# Altium project HV Interface.PrjPcb (part 2 of 2)

## Sheet MCU.SchDoc
size Letter; DocumentNumber: 5; SheetNumber: 5; SheetTotal: 7
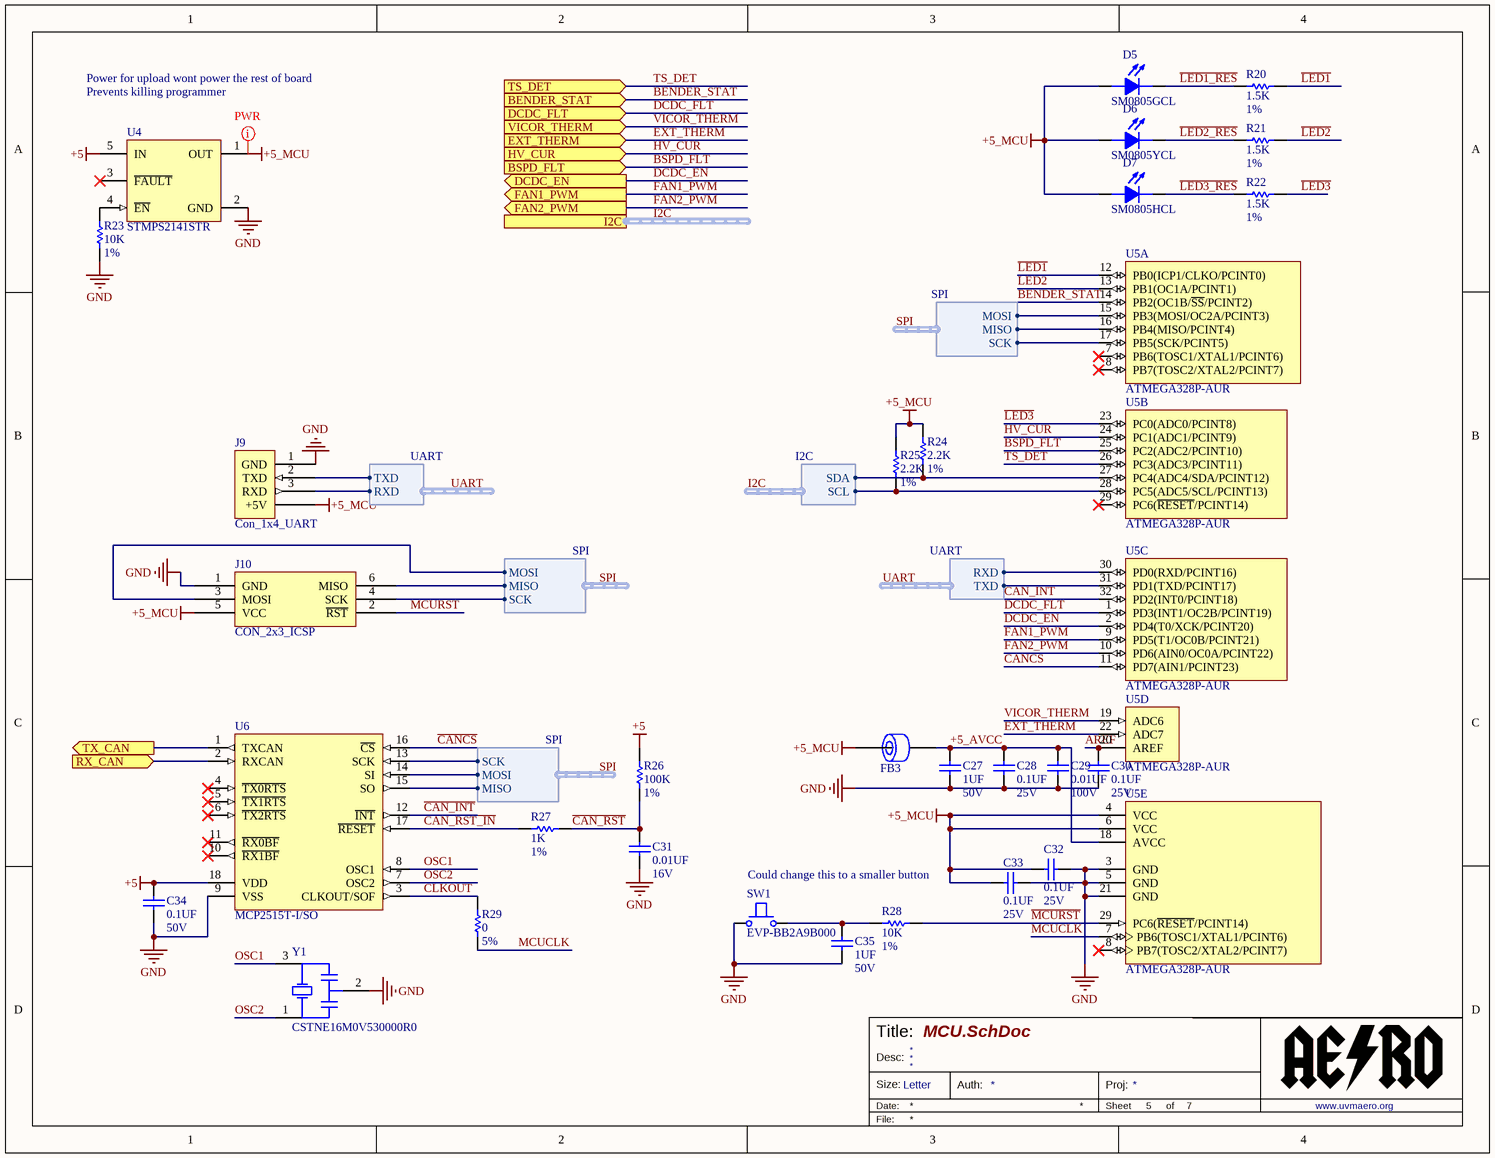
[diagram p3: MCU.SchDoc]

### Parts
C27  Val: 1UF  Vol: 50V  [0603_CAP]  (hidden comment: CAP 0603 1UF 50V 10% X7R)
C28  Val: 0.1UF  Vol: 25V  [0603_CAP]  (hidden comment: CAP 0603 0.1UF 25V 10% X7R)
C29  Val: 0.01UF  Vol: 100V  [0603_CAP]  (hidden comment: CAP 0603 0.01UF 100V 10% X7R)
C30  Val: 0.1UF  Vol: 25V  [0603_CAP]  (hidden comment: CAP 0603 0.1UF 25V 10% X7R)
C31  Val: 0.01UF  Vol: 16V  [0603_CAP]  (hidden comment: CAP 0603 0.01UF 16V 10% X7R)
C32  Val: 0.1UF  Vol: 25V  [0603_CAP]  (hidden comment: CAP 0603 0.1UF 25V 10% X7R)
C33  Val: 0.1UF  Vol: 25V  [0603_CAP]  (hidden comment: CAP 0603 0.1UF 25V 10% X7R)
C34  Val: 0.1UF  Vol: 50V  [0603_CAP]  (hidden comment: CAP 0603 0.1UF 50V 10% X7R)
C35  Val: 1UF  Vol: 50V  [0603_CAP]  (hidden comment: CAP 0603 1UF 50V 10% X7R)
D5  SM0805GCL  [LEDC2012X135N_SM0805GCL(Primary)]
D6  SM0805YCL  [LEDC2012X135N_SM0805YCL(Primary)]
D7  SM0805HCL  [LEDC2012X135N_SM0805HCL(Primary)]
FB3  Ferrite Chip 2500 Ohms  [0603]  (value not drawn)
J9  Con_1x4_UART  [Con 1x4 UART]
J10  CON_2x3_ICSP  [CON_2x3_ICSP]
R20  Val: 1.5K  Tol: 1%  [0603_RES]  (hidden comment: RES 0603 1.5K 1%)
R21  Val: 1.5K  Tol: 1%  [0603_RES]  (hidden comment: RES 0603 1.5K 1%)
R22  Val: 1.5K  Tol: 1%  [0603_RES]  (hidden comment: RES 0603 1.5K 1%)
R23  Val: 10K  Tol: 1%  [0603_RES]  (hidden comment: RES 0603 10K 1%)
R24  Val: 2.2K  Tol: 1%  [0603_RES]  (hidden comment: RES 0603 2.2K 1%)
R25  Val: 2.2K  Tol: 1%  [0603_RES]  (hidden comment: RES 0603 2.2K 1%)
R26  Val: 100K  Tol: 1%  [0603_RES]  (hidden comment: RES 0603 100K 1%)
R27  Val: 1K  Tol: 1%  [0603_RES]  (hidden comment: RES 0603 1K 1%)
R28  Val: 10K  Tol: 1%  [0603_RES]  (hidden comment: RES 0603 10K 1%)
R29  Val: 0  Tol: 5%  [0603_RES]  (hidden comment: RES 0603 0 5%)
SW1  EVP-BB2A9B000  [EVP-BB2A9B000]
U4  STMPS2141STR  [SOT95P280X145-5N]
U5  ATMEGA328P-AUR  [TQFP80P900X900X120-32N]  (parts A,B,C,D,E of 5)
U6  MCP2515T-I/SO  [SOIC-18]
Y1  CSTNE16M0V530000R0  [MURA-CSTCE_G_A-3_V]

### Ports
BENDER_STAT (in), BSPD_FLT (in), DCDC_EN (out), DCDC_FLT (in), EXT_THERM (in), FAN1_PWM (out), FAN2_PWM (out), HV_CUR (in), I2C (harness I2C), RX_CAN (in), TS_DET (in), TX_CAN (out), VICOR_THERM (in)

### Harnesses
I2C: SCL, SDA
SPI: MOSI, MISO, SCK
UART: RXD, TXD

### Nets
+5: C34.2 R26.2 U4.5(IN) U6.18(VDD)
+5_MCU: C32.1 C33.1 D5.A D6.A D7.A FB3.1 J9.4(+5V) J10.5(VCC) R24.2 R25.2 U4.1(OUT) U5.4(VCC) U5.6(VCC)
GND: C27.1 C28.1 C29.1 C30.1 C31.1 C32.2 C33.2 C34.1 C35.1 J9.1(GND) J10.1(GND) R23.1 SW1.A U4.2(GND) U5.3(GND) U5.5(GND) U5.21(GND) U6.9(VSS) Y1.2(GND)
+5_AVCC: C27.2 C28.2 C29.2 FB3.2 U5.18(AVCC)
~{CAN_INT}: U5.32(PD2(INT0/PCINT18)) U6.12(~{INT})
~{CAN_RST}: C31.2 R26.1 R27.2
~{CAN_RST_IN}: R27.1 U6.17(~{RESET})
~{CANCS}: U5.11(PD7(AIN1/PCINT23)) U6.16(~{CS})
~{LED1}: R20.2 U5.12(PB0(ICP1/CLKO/PCINT0))
~{LED1_RES}: D5.C R20.1
~{LED2}: R21.2 U5.13(PB1(OC1A/PCINT1))
~{LED2_RES}: D6.C R21.1
~{LED3}: R22.2 U5.23(PC0(ADC0/PCINT8))
~{LED3_RES}: D7.C R22.1
~{MCURST}: J10.2(~{RST}) R28.1 U5.29(PC6(~{RESET}/PCINT14))
AREF: C30.2 U5.20(AREF)
BENDER_STAT: U5.14(PB2(OC1B/~{SS}/PCINT2)) ; port BENDER_STAT
BSPD_FLT: U5.25(PC2(ADC2/PCINT10)) ; port BSPD_FLT  [project net BSPD_FAULT]
CLKOUT: R29.1 U6.3(CLKOUT/SOF)
DCDC_EN: U5.2(PD4(T0/XCK/PCINT20)) ; port DCDC_EN
DCDC_FLT: U5.1(PD3(INT1/OC2B/PCINT19)) ; port DCDC_FLT
EXT_THERM: U5.22(ADC7) ; port EXT_THERM  [project net EXT_NTC_N]
FAN1_PWM: U5.9(PD5(T1/OC0B/PCINT21)) ; port FAN1_PWM
FAN2_PWM: U5.10(PD6(AIN0/OC0A/PCINT22)) ; port FAN2_PWM
HV_CUR: U5.24(PC1(ADC1/PCINT9)) ; port HV_CUR  [project net CUR_OUT]
I2C.SCL: R25.1 U5.28(PC5(ADC5/SCL/PCINT13)) ; port I2C.SCL
I2C.SDA: R24.1 U5.27(PC4(ADC4/SDA/PCINT12)) ; port I2C.SDA
MCUCLK: R29.2 U5.7(PB6(TOSC1/XTAL1/PCINT6))
OSC1: U6.8(OSC1) Y1.3(X2)
OSC2: U6.7(OSC2) Y1.1(X1)
RX: U6.2(RXCAN) ; port RX_CAN
SPI.MISO: J10.6(MISO) U5.16(PB4(MISO/PCINT4)) U6.15(SO) ; harness SPI.MISO
SPI.MOSI: J10.3(MOSI) U5.15(PB3(MOSI/OC2A/PCINT3)) U6.14(SI) ; harness SPI.MOSI
SPI.SCK: J10.4(SCK) U5.17(PB5(SCK/PCINT5)) U6.13(SCK) ; harness SPI.SCK
TS_DET: U5.26(PC3(ADC3/PCINT11)) ; port TS_DET
TX: U6.1(TXCAN) ; port TX_CAN
UART.RXD: J9.3(RXD) U5.30(PD0(RXD/PCINT16)) ; harness UART.RXD
UART.TXD: J9.2(TXD) U5.31(PD1(TXD/PCINT17)) ; harness UART.TXD
VICOR_THERM: U5.19(ADC6) ; port VICOR_THERM  [project net VICOR_NTC]
NetC35_2: C35.2 R28.2 SW1.B
NetR23_2: R23.2 U4.4(~{EN})

Not connected (* = marked no-connect by the designer): U4 3(~{FAULT})*; U5 8(PB7(TOSC2/XTAL2/PCINT7))*; U6 4(~{TX0RTS})* 5(~{TX1RTS})* 6(~{TX2RTS})* 10(~{RX1BF})* 11(~{RX0BF})*

### Buses and harness runs
harness I2C = port I2C

### Layout directives
net class PWR; net class PWR_RAIL: +5_MCU

### Notes on the sheet
- Power for upload wont power the rest of board
- Prevents killing programmer
- Could change this to a smaller button
- Title:
- Size:
- Date:
- Desc:
- Letter
- Auth:
- Sheet
- Proj:
- *
- of
- www.uvmaero.org
- File:

### Library data of the parts
C27 C35 = CAP 0603 1UF 50V 10% X7R: Capacitor Surface Mount 0603 Footprint 1UF 50V 10% Tolerance Ceramic X7R; Manufacturer: Various; PCB Package: 0603; Description in Visual: Cap SMT 0603 1UF 50V 10% Ceramic X7R; P/N: CAP 0603 1UF 50V 10% X7R; Manufacturer P/N: Various; Value: 1UF; Voltage: 50V; Tolerance: 10%; Type: Ceramic X7R; ComponentLink1Description: Manufacturer Website; ComponentLink2Description: Component Datasheet; ComponentLink3Description: Octopart Link
C28 C30 C32 C33 = CAP 0603 0.1UF 25V 10% X7R: Capacitor Surface Mount 0603 Footprint 0.1UF 25V 10% Tolerance Ceramic X7R; Manufacturer: Various; PCB Package: 0603; Description in Visual: Cap SMT 0603 0.1UF 25V 10%  Cer X7R; P/N: CAP 0603 0.1UF 25V 10% X7R; Manufacturer P/N: Various; Value: 0.1UF; Voltage: 25V; Tolerance: 10%; Type: Ceramic X7R; ComponentLink1Description: Manufacturer Website; ComponentLink2Description: Component Datasheet; ComponentLink3Description: Octopart Link
C29 = CAP 0603 0.01UF 100V 10% X7R: Capacitor Surface Mount 0603 Footprint 0.01UF 100V 10% Tolerance Ceramic X7R; Manufacturer: Various; PCB Package: 0603; Description in Visual: Cap SMT 0603 0.01UF 100V 10%  Cer X7R; P/N: CAP 0603 0.01UF 100V 10% X7R; Manufacturer P/N: Various; Value: 0.01UF; Voltage: 100V; Tolerance: 10%; Type: Ceramic X7R; ComponentLink1Description: Manufacturer Website; ComponentLink2Description: Component Datasheet; ComponentLink3Description: Octopart Link
C31 = CAP 0603 0.01UF 16V 10% X7R: Capacitor Surface Mount 0603 Footprint 0.01UF 16V 10% Tolerance Ceramic X7R; Manufacturer: Various; PCB Package: 0603; Description in Visual: Cap SMT 0603 0.01UF 16V 10%  Cer X7R; P/N: CAP 0603 0.01UF 16V 10% X7R; Manufacturer P/N: Various; Value: 0.01UF; Voltage: 16V; Tolerance: 10%; Type: Ceramic X7R; ComponentLink1Description: Manufacturer Website; ComponentLink2Description: Component Datasheet; ComponentLink3Description: Octopart Link
C34 = CAP 0603 0.1UF 50V 10% X7R: Capacitor Surface Mount 0603 Footprint 0.1UF 50V 10% Tolerance Ceramic X7R; Manufacturer: Various; PCB Package: 0603; Description in Visual: Cap SMT 0603 0.1UF 50V 10%  Cer X7R; P/N: CAP 0603 0.1UF 50V 10% X7R; Manufacturer P/N: Various; Value: 0.1UF; Voltage: 50V; Tolerance: 10%; Type: Ceramic X7R; ComponentLink1Description: Manufacturer Website; ComponentLink2Description: Component Datasheet; ComponentLink3Description: Octopart Link
D5 = SM0805GCL: Green 574nm LED Indication - Discrete 1.9V 0805 (2012 Metric); Manufacturer: Bivar; Forward Current: 2mA; Lens Color: Colorless; Lens Transparency: Clear; Luminous Intensity: 3.6mcd; Viewing Angle: 130°; Supplier 1: Digi-Key; Supplier Part Number 1: 492-2525-1-ND; Case Code (Imperial): 0805; Case Code (Metric): 2012; Case/Package: 0805; Category: LEDs; Color: Green; Dominant Wavelength: 574nm; Forward Voltage: 1.9V; Height: 0.8mm; Illumination Color: Green; Lead Free: Lead Free; Length: 2mm; Manufacturer Part Number: SM0805GCL; Max Operating Temperature: 80°C; Min Operating Temperature: -30°C; Mount: Surface Mount; Package Quantity: 4000; Packaging: Tape and Reel; Test Current: 2mA; Width: 1.2mm
D6 = SM0805YCL: Yellow 592nm LED Indication - Discrete 1.9V 0805 (2012 Metric); Manufacturer: Bivar; Forward Current: 2mA; Lens Color: Colorless; Lens Transparency: Clear; Luminous Intensity: 11.5mcd; Viewing Angle: 130°; Case Code (Imperial): 0805; Case Code (Metric): 2012; Case/Package: 0805; Category: LEDs; Color: Yellow; Dominant Wavelength: 592nm; Forward Voltage: 1.9V; Height: 0.8mm; Illumination Color: Yellow; Lead Free: Lead Free; Length: 2mm; Manufacturer Part Number: SM0805YCL; Max Operating Temperature: 80°C; Min Operating Temperature: -30°C; Mount: Surface Mount; Package Quantity: 4000; Packaging: Tape and Reel; Test Current: 2mA; Width: 1.2mm; Supplier 1: Digi-Key; Supplier Part Number 1: 492-2526-1-ND
D7 = SM0805HCL: Red 631nm LED Indication - Discrete 1.9V 0805 (2012 Metric); Manufacturer: Bivar; Forward Current: 2mA; Lens Color: Colorless; Lens Transparency: Clear; Luminous Intensity: 11.5mcd; Power Rating: 78mW; Viewing Angle: 130°; Supplier 1: Digi-Key; Supplier Part Number 1: 492-2281-1-ND; Width: 1.2mm; Case Code (Imperial): 0805; Case Code (Metric): 2012; Case/Package: 0805; Category: LEDs; Color: Red; Dominant Wavelength: 631nm; Forward Voltage: 1.9V; Height: 0.8mm; Illumination Color: Red; Lead Free: Lead Free; Length: 2mm; Manufacturer Part Number: SM0805HCL; Max Operating Temperature: 80°C; Min Operating Temperature: -30°C; Mount: Surface Mount; Package Quantity: 4000; Packaging: Tape and Reel; Test Current: 2mA
FB3 = MMZ1608A252B: Ferrite Chip 200 mA 2500 Ohms Differential Mode - Single 0603 Footprint; Manufacturer: TDK; Description in Visual: Ferrite SMT 200mA 2500Ohm Dif Mode 0603; Usage: Signal Line; Current (mA): 200; Frequency: 100 MHz; Impedance at Freq (ohms): 2500; DC Resistance (ohms): 0.8; P/N: MMZ1608A252B; Manufacturer P/N: MMZ1608A252B; Filter type: Differential Mode - Single; Operating Temperature Range: -55 to +125 °C; PCB Package: 0603; ComponentLink1Description: Manufacturer Website; ComponentLink1URL: http://www.tdk.com/; ComponentLink2Description: Component Datasheet; ComponentLink2URL: http://www.tdk.co.jp/tefe02/e9412_mmz1608.pdf; ComponentLink3Description: Octopart Link; ComponentLink3URL: http://octopart.com/partsearch/#search/requestData&q=MMZ1608A252B
J9 = Con_1x4_UART: Connector Header Through Hole 4 position 0.100" (2.54mm); Manufacturer: Wurth Electronics; Manufacturer Part Number: 61300411121; Connector Type: Male Pin; Gender: Male; Number of Contacts: 4; Pitch: 0.1inch; Supplier Part Number 1: 732-5317-ND; Supplier Part Number 2: H123038-ND; Category: Connectors; Color: Black; Contact Material: Copper; Contact Mating Length: 0.236inch; Contact Plating: Gold; Lead Free: Lead Free; Mount: Through Hole; Number of Positions: 4; Number of Rows: 1; Packaging: Bulk; REACH SVHC: Unknown; Termination: Solder; Supplier 1: Digi-Key; Supplier 2: Digi-Key
J10 = CON_2x3_ICSP: Connector Header Through Hole 6 position 0.100" (2.54mm) for AVR ICSP; Supplier 1: Digi-Key; Supplier 2: Digi-Key; Supplier 3: Allied Electronics; Supplier 4: Digi-Key; Supplier Part Number 1: 732-5295-ND; Supplier Part Number 2: 952-2120-ND; Supplier Part Number 3: 70949531; Supplier Part Number 4: S2011EC-03-ND
R20-R22 = RES 0603 1.5K 1%: Resistor Surface Mount, 1.5K Ohms, 0603 Footprint, 1% Tolerance 0.1W; Manufacturer: Various; PCB Package: 0603; Description in Visual: Res SMT 1.5K 0603  1%  0.1W; P/N: RES 0603 1.5K 1%; Manufacturer P/N: Various; Value: 1.5K; Power_Rating: 0.1W; Tolerance: 1%
R23 R28 = RES 0603 10K 1%: Resistor Surface Mount, 10K Ohms, 0603 Footprint, 1% Tolerance 0.1W; Manufacturer: Various; PCB Package: 0603; Description in Visual: Res SMT 10K 0603  1%  0.1W; P/N: RES 0603 10K 1%; Manufacturer P/N: Various; Value: 10K; Power_Rating: 0.1W; Tolerance: 1%
R24 R25 = RES 0603 2.2K 1%: Resistor Surface Mount, 2.2K Ohms, 0603 Footprint, 1% Tolerance 0.1W; Manufacturer: Various; PCB Package: 0603; Description in Visual: Res SMT 2.2K 0603  1%  0.1W; P/N: RES 0603 2.2K 1%; Manufacturer P/N: Various; Value: 2.2K; Power_Rating: 0.1W; Tolerance: 1%
R26 = RES 0603 100K 1%: Resistor Surface Mount, 100K Ohms, 0603 Footprint, 1% Tolerance 0.1W; Manufacturer: Various; PCB Package: 0603; Description in Visual: Res SMT 100K 0603  1%  0.1W; P/N: RES 0603 100K 1%; Manufacturer P/N: Various; Value: 100K; Power_Rating: 0.1W; Tolerance: 1%
R27 = RES 0603 1K 1%: Resistor Surface Mount, 1K Ohms, 0603 Footprint, 1% Tolerance 0.1W; Manufacturer: Various; PCB Package: 0603; Description in Visual: Res SMT 1K 0603  1%  0.1W; P/N: RES 0603 1K 1%; Manufacturer P/N: Various; Value: 1K; Power_Rating: 0.1W; Tolerance: 1%
R29 = RES 0603 0 5%: Resistor Surface Mount, 0 Ohms, 0603 Footprint, 5% Tolerance 0.1W; Manufacturer: Various; PCB Package: 0603; Description in Visual: Res SMT 0 0603  5%  0.1W; Value: 0; P/N: RES 0603 0 5%; Manufacturer P/N: Various; Power_Rating: 0.1W; Tolerance: 5%
SW1 = EVP-BB2A9B000: Tactile Switch SPST-NO Top Actuated Surface Mount; Manufacturer: Panasonic; Actuator Type: Standard; Illumination Type: Non-Illuminated; Mechanical Life: 500000Cycles; Operating Force: 160gf; Switch Function: Off-Mom; Switch Travel: 0.11mm; Throw Configuration: SPST; Supplier 1: Digi-Key; Supplier Part Number 1: P19888CT-ND; Category: Tactile Switches; Lead Free: Lead Free; Manufacturer Part Number: EVP-BB2A9B000; Max Operating Temperature: 85°C; Min Operating Temperature: -40°C; Mount: Surface Mount; Packaging: Tape and Reel; Termination: Gull Wing
U4 = STMPS2141STR: Power Switch/Driver 1:1 N-Channel 500mA SOT-23-5; Manufacturer: STMicroelectronics; Mfg Package Ident: SOT23-5L; Voltage - Load: 2.7 V ~ 5.5 V; Rds On (Typ): 90 mOhm; helpURL: https://upverter.com/upn/revision/bed08d647fcd8b7a/; ComponentLink2Description: Datasheet; Temperature: -40°C to +125°C; Package: SOT23-5L; Supplier 2: Mouser; Price: 0.377534036938; Supplier 1: Digi-Key; ComponentLink1URL: https://upverter.com/upn/revision/bed08d647fcd8b7a/; Supplier Part Number 2: 511-STMPS2141STR; Supplier Part Number 1: 497-6933-1-ND; ComponentLink1Description: Upverter; ComponentLink2URL: http://www.st.com/content/ccc/resource/technical/document/datasheet/e8/d7/48/25/eb/87/45/b3/CD00167470.pdf/files/CD00167470.pdf/jcr:content/translations/en.CD00167470.pdf; RoHS: TRUE; Mouser Part Number: 511-STMPS2141STR; Current - Output (Max): 500mA; Temperature Range High: +125°C; Digikey Description: IC PWR SWITCH 1CH 500MA SOT23-5; Manufacturer Product Page: http://www.st.com/content/st_com/en/products/switches-and-multiplexers/power-load-switches/stmps2141.html; Digikey Part Number: 497-6933-1-ND; Lead Free: yes; Temperature Range Low: -40°C; Part Number: STMPS2141STR
U5 = ATMEGA328P-AUR: AVR AVR® ATmega Microcontroller IC 8-Bit 20MHz 32KB (16K x 16) FLASH 32-TQFP (7x7); Manufacturer: Microchip / Atmel; Data Bus Width: 8b; Interface: I2C,SPI,UART,USART,2-Wire; Max Supply Voltage: 5.5V; Min Supply Voltage: 1.8V; Number of I/Os: 23; Number of Timers/Counters: 3; Oscillator Type: Internal; Peripherals: Brown-out Detect/Reset,POR,PWM,WDT; RAM Size: 2KB; Watchdog Timer: Yes; Supplier 1: Digi-Key; Supplier Part Number 1: ATMEGA328P-AURCT-ND; Case/Package: A; Category: Microcontrollers; Contact Plating: Tin,Matte; Core Architecture: AVR; Frequency: 20MHz; Lead Free: Lead Free; Manufacturer Part Number: ATMEGA328P-AUR; Max Frequency: 20MHz; Max Operating Temperature: 85°C; Memory Size: 32KB; Memory Type: FLASH; Min Operating Temperature: -40°C; Mount: Surface Mount; Number of Pins: 32; Number of Programmable I/O: 23; Package Quantity: 2000; Packaging: Tape and Reel; REACH SVHC: No SVHC
U6 = MCP2515T-I/SO: CANbus Controller CAN 2.0 SPI Interface 18-SOIC; Manufacturer: Microchip; Data Rate: 1Mbps; Interface: SPI,CAN; Max Supply Current: 10mA; Max Supply Voltage: 5.5V; Min Supply Voltage: 2.7V; Number of Drivers: 1; Number of Receive Buffers: 2; Number of Transmit Buffers: 3; Operating Supply Voltage: 5V; RevisionNote: URLs added. DatasheetVersion updated.; ComponentLink1Description: Manufacturer URL; Code_JEDEC: MS-013; ComponentLink2URL: http://ww1.microchip.com/downloads/en/DeviceDoc/21801f.pdf; ComponentLink3Description: Package Specification; PackageVersion: revBB, Aug-2009; PackageReference: SOIC-SO18; ComponentLink2Description: Datasheet; DatasheetVersion: revF, Oct-2010; PackageDescription: 18-Lead Plastic Small Outline (SO) - Wide 7.50mm Body [SOIC]; ComponentLink1URL: http://www.microchip.com/; ComponentLink3URL: http://www.microchip.com/stellent/groups/techpub_sg/documents/packagingspec/en012702.pdf; Case/Package: SOIC; Category: Interface ICs; Lead Free: Lead Free; Manufacturer Part Number: MCP2515T-I/SO; Max Operating Temperature: 85°C; Min Operating Temperature: -40°C; Mount: Surface Mount; Nominal Supply Current: 10mA; Number of Pins: 18; Number of Receivers: 1; Number of Transceivers: 1; Operating Supply Current: 10mA; Package Quantity: 1100; Packaging: Tape and Reel; Radiation Hardening: No; REACH SVHC: No SVHC
Y1 = CSTNE16M0V530000R0: Ceramic Resonator, 8 MHz, +/- 0.5%, -20 to 80 degC, 3-Pin SMD, RoHS, Tape and Reel; Manufacturer: Murata; Capacitance: 15pF; Frequency: 16MHz; Frequency Stability: 0.3%; Impedance: 40R; Packaging: Tape and Reel; Case/Package: SMD/SMT; Composition: Ceramic; Frequency Tolerance: 0.5%; Manufacturer Part Number: CSTNE16M0V530000R0; Max Operating Temperature: 85°C; Min Operating Temperature: -40°C; Mount: Surface Mount; Supplier 1: Digi-Key; Supplier Part Number 1: 490-17948-1-ND

## Sheet Power Supply.SchDoc
size Letter; DocumentNumber: 6; SheetNumber: 6; SheetTotal: 7
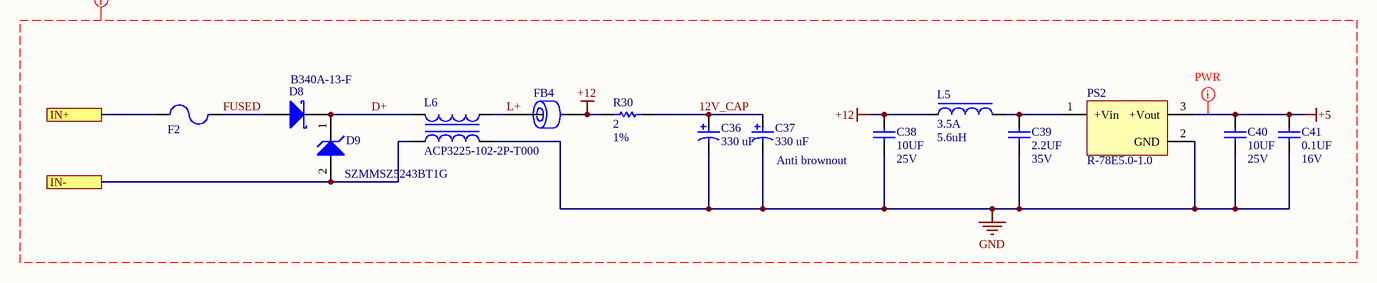
[diagram p4: Power Supply.SchDoc]

### Parts
C36  Rated Capacitance: 330 uF  [NIC-CAPA2-10X10_V]  (hidden comment: UUD1V331MNL1GS)
C37  Rated Capacitance: 330 uF  [NIC-CAPA2-10X10_V]  (hidden comment: UUD1V331MNL1GS)
C38  Val: 10UF  Vol: 25V  [0603_CAP]  (hidden comment: CAP 0603 10UF 25V 20% X5R)
C39  Val: 2.2UF  Vol: 35V  [0603_CAP]  (hidden comment: CAP 0603 2.2UF 35V 10% X5R)
C40  Val: 10UF  Vol: 25V  [0603_CAP]  (hidden comment: CAP 0603 10UF 25V 20% X5R)
C41  Val: 0.1UF  Vol: 16V  [0603_CAP]  (hidden comment: CAP 0603 0.1UF 16V 10% X7R)
D8  B340A-13-F  [DIOD-SMA-2_V]
D9  SZMMSZ5243BT1G  [ONSC-SOD-123-2-425-04_V]
F2  500 mA PTC  [1812RF]  (value not drawn)
FB4  Ferrite Chip 1500 Ohms  [0805]  (value not drawn)
L5  Current Rating: 3.5A  Inductance: 5.6uH  [B1047AS-5R6N=P3]  (hidden comment: B1047AS-5R6N=P3)
L6  ACP3225-102-2P-T000  [TDK-ACP3225-102-2P-T000-4_V]
PS2  R-78E5.0-1.0  [R-78E5.0]
R30  Val: 2  Tol: 1%  [0805_RES]  (hidden comment: RES 0805 2 1%)

### Ports
IN+, IN-

### Nets
+5: C40.2 C41.2 PS2.3(+Vout)
+12: C38.2 FB4.2 L5.1 R30.1
GND: C36.2 C37.2 C38.1 C39.1 C40.1 C41.1 L6.4 PS2.2(GND)
12V_CAP: C36.1 C37.1 R30.2
D+: D8.2(K) D9.1(K) L6.2
FUSED: D8.1(A) F2.2
IN+: F2.1 ; port IN+
IN-: D9.2(A) L6.1 ; port IN-
L+: FB4.1 L6.3
NetC39_2: C39.2 L5.2 PS2.1(+Vin)

### Layout directives
net class PWR; net class PWR_RAIL: +5
net class PWR: 12V_CAP, +5, +12, D+, FUSED, GND, L+

### Notes on the sheet
- Anti brownout
- Title:
- Size:
- Date:
- Desc:
- Letter
- Auth:
- Sheet
- Proj:
- *
- of
- www.uvmaero.org
- File:

### Library data of the parts
C36 C37 = UUD1V331MNL1GS: Aluminum Electrolytic Capacitor, UD Series, Low Impedance, 330 uF, 35 V, + / - 20%, -55 to 105 degC, Chip Type, 10 x 10 mm D x L, Pb-Free, Reel; Manufacturer: Nichicon; Tolerance Rated Capacitance: -20 to 20%; Packing: Dia382mm Reel; Rated Voltage: 35 V; Rated Ripple Current (at 100kHz): 670 mA; Impedance: 0.09 Ohm; Endurance Time: 5000 h; Mounting Technology: Surface Mount; ComponentLink1Description: Manufacturer URL; PackageReference: CAPAE-D10H10; PartNumber: UUD1V331MNL1GS; ComponentLink2Description: Datasheet; Diameter: 10 mm; PackageDescription: 2-Pin Surface Mount Device, Diameter 10 mm, Height 10 mm, Pitch 8 mm; ComponentLink2URL: http://products.nichicon.co.jp/en/pdf/XJA043/e-ud.pdf; Length: 10 mm; ComponentLink3URL: http://products.nichicon.co.jp/en/pdf/XJA043/e-ud.pdf; DatasheetVersion: 08/2012; ComponentLink3Description: Package Specification; ComponentLink1URL: http://www.nichicon.co.jp/; RoHS: TRUE; Manufacturer 1: Nichicon; Manufacturer Part Number 1: UUD1V331MNL1GS; Supplier 1: Digi-Key; Supplier Part Number 1: 493-2293-1-ND
C38 C40 = CAP 0603 10UF 25V 20% X5R: Capacitor Surface Mount 0603 Footprint 10UF 25V 20% Tolerance Ceramic X5R; Manufacturer: Various; PCB Package: 0603; Description in Visual: Cap SMT 0603 10UF 25V 20% Ceramic X5R; P/N: CAP 0603 10UF 25V 20% X5R; Manufacturer P/N: Various; Value: 10UF; Voltage: 25V; Tolerance: 20%; Type: Ceramic X5R; ComponentLink1Description: Manufacturer Website; ComponentLink2Description: Component Datasheet; ComponentLink3Description: Octopart Link
C39 = CAP 0603 2.2UF 35V 10% X5R: Capacitor Surface Mount 0603 Footprint 2.2UF 35V 10% Tolerance Ceramic X5R; Manufacturer: Various; PCB Package: 0603; Description in Visual: Cap SMT 0603 2.2UF 35V 10%  Cer X5R; P/N: CAP 0603 2.2UF 35V 10% X5R; Manufacturer P/N: Various; Value: 2.2UF; Voltage: 35V; Tolerance: 10%; Type: Ceramic X5R; ComponentLink1Description: Manufacturer Website; ComponentLink2Description: Component Datasheet; ComponentLink3Description: Octopart Link
C41 = CAP 0603 0.1UF 16V 10% X7R: Capacitor Surface Mount 0603 Footprint 0.1UF 16V 10% Tolerance Ceramic X7R; Manufacturer: Various; PCB Package: 0603; Description in Visual: Cap SMT 0603 0.1UF 16V 10%  Cer X7R; P/N: CAP 0603 0.1UF 16V 10% X7R; Manufacturer P/N: Various; Value: 0.1UF; Voltage: 16V; Tolerance: 10%; Type: Ceramic X7R; ComponentLink1Description: Manufacturer Website; ComponentLink2Description: Component Datasheet; ComponentLink3Description: Octopart Link
D8 = CMP-1667-00003-1: Surface Mount Schottky Barrier Rectifier, 40 V, 3 A, -55 to 150 degC, 2-Pin SMA, RoHS, Tape and Reel; Forward Current: 3 A; Forward Voltage: 500 mV; Max Surge Current: 80 A; Peak Reverse Current: 500 uA; Elements: 1; Mounting Technology: Surface Mount; ComponentLink1URL: http://www.diodes.com/; PackageDescription: 2-Pin Surface Mounted Assembly, Body 4.3 x 2.605 mm, Height 2.4 mm; Min Operating Temperature: -55 degC; Mount: Surface Mount; Pins: 2; ComponentLink2URL: http://www.diodes.com/_files/datasheets/ds30891.pdf; PackageReference: SMA-2; Max Operating Temperature: 125 degC; Radiation Hardening: No; Length: 4.6 mm; RoHSCompliant: true; ComponentLink1Description: Manufacturer URL; Height: 2.1 mm; ComponentLink2Description: Datasheet; Packaging: Tape and Reel; Package Quantity: 5000; Case\Package: SMA; DatasheetVersion: Rev. 17 - 2, 09/2015; REACH SVHC: No SVHC; Width: 2.92 mm
D9 = CMP-1060-00481-1: Zener Voltage Regulator, 500 mW, 2-Pin SOD-123, Pb-Free, Tape and Reel; Manufacturer: On Semiconductor; VZ Typ (V): 13; P Max (W): 0.5; DatasheetVersion: Rev. 12; RoHS: Pb-Free; PartNumber: SZMMSZ5243BT1G; ComponentLink3Description: Package Specification; ComponentLink1URL: http://www.onsemi.com/; PackageReference: SOD-123-2-425-04; ComponentLink2Description: Datasheet; PackageVersion: Rev. G, 10/2009; Packing: Tape and Reel; Mounting Technology: Surface Mount; ComponentLink1Description: Manufacturer URL; PackageDescription: 2-Pin SOD, Body 1.6 x 2.69 mm; ComponentLink2URL: http://www.onsemi.cn/pub_link/Collateral/MMSZ5221BT1-D.PDF; ComponentLink3URL: http://www.onsemi.com/pub_link/Collateral/425-04.PDF
F2 = MF-MSMF050: 500 mA 15 VDC PTC resettable fuse 1812 footprint; Manufacturer: Bourns; Description in Visual: Fuse Resettable SMT 500mA 15VDC 1812; Hold Current (mA): 500; Trip Current (mA): 1000; Max Current (A): 100; Max Voltage (V): 15; Time to Trip (sec): 0.15; Resistance (max) (Ohms): 1; PCB Package: 1812; P/N: MF-MSMF050; Manufacturer P/N: MF-MSMF050; Resistance (min) (Ohms): 0.15; ComponentLink1Description: Manufacturer Website; ComponentLink1URL: http://www.bourns.com; ComponentLink2Description: Component Datasheet; ComponentLink3Description: Octopart Link; ComponentLink3URL: http://octopart.com/partsearch/#search/requestData&q=MF-MSMF050
FB4 = 742792097: Ferrite Chip 1000 mA 1500 Ohms Differential Mode - Single 0805 Footprint; Manufacturer: Wurth Electronics; Description in Visual: Ferrite SMT 1000mA 1500Ohm Dif Mode 0805; Usage: Power Supply; Current (mA): 1000; Frequency: 100 MHz; Impedance at Freq (ohms): 1500; DC Resistance (ohms): 0.3; P/N: 742792097; Manufacturer P/N: 742792097; Filter type: Differential Mode - Single; Operating Temperature Range: -55 to +125 °C; PCB Package: 0805; ComponentLink1Description: Manufacturer Website; ComponentLink1URL: http://www.we-online.com; ComponentLink2Description: Component Datasheet; ComponentLink2URL: http://www.we-online.com/eisos/pdf/742792097.pdf; ComponentLink3Description: Octopart Link; ComponentLink3URL: http://octopart.com/partsearch/#search/requestData&q=742792097
L5 = B1047AS-5R6N=P3: 5.6µH Shielded Wirewound Inductor 3.5A 32mOhm Max Nonstandard; Manufacturer: Murata; Core Material: Ferrite; DC Resistance (DCR): 32mR; Saturation Current: 4A; Test Frequency: 100kHz; Tolerance: 30%; Case/Package: Nonstandard; Category: Fixed Inductors; Composition: Wirewound; Height - Seated (Max): 0.197inch; Length: 0.299inch; Manufacturer Part Number: B1047AS-5R6N=P3; Max Operating Temperature: 85°C; Min Operating Temperature: -40°C; Mount: Surface Mount; Packaging: Tape and Reel; Shielding: Shielded; Width: 0.299inch; Supplier 1: Digi-Key; Supplier Part Number 1: 490-14216-1-ND
L6 = ACP3225-102-2P-T000: Common Mode Filter, 1000 Ohm Impedance, 1.2 A, 60 V, -40 to 85 degC, 4-Pin SMD, RoHS, Tape and Reel; Manufacturer: TDK; Online Catalog: ACPSeries; Other Names: 445-8637-6; Current: 1.5A; Featured Product: ACP3225SeriesFilter; Number of Lines: 2; Filter Type: PowerLine; Impedance: 1kOhm; DC Resistance (DCR): 50mOhm; Manufacturer URL: http://www.tdk.com/; Package Description: 4-Pin Surface Mount Device, Body 3.2 x 2.5 mm, Pitch 1.15 mm; Datasheet Version: Rev. 8, 07/2011; Package / Case: 1210(3225Metric),4Lead; Packaging: Digi-Reel; Inductance: -; Height (Max): 0.079"(2.00mm); Operating Temperature: -40degC~85degC; Size / Dimension: 0.126"Lx0.098"W(3.20mmx2.50mm); Datasheet URL: https://datasheet.ciiva.com/30106/acp3225-series-30106482.pdf; Standard Package: 1; Series: ACP; Mounting Type: SurfaceMount; Package Reference: ACP3225-102-2P-T000-4; Family: CommonModeChokes; Category: Filters; Manufacturer 1: TDK; Manufacturer Part Number 1: ACP3225-102-2P-T000
PS2 = R-78E5.0-1.0: Linear Regulator Replacement DC DC Converter 1 Output 5V    1A 8V - 28V Input; Manufacturer: Recom; Efficiency: 91%; Max Power Dissipation: 5W; Number of Outputs: 1; Case/Package: SIP; Category: Board Mount Modules; Current - Output 1: 1A; Features: SCP; Height: 10.4mm; Lead Free: Lead Free; Length: 11.6mm; Manufacturer Part Number: R-78E5.0-1.0; Max Input Voltage: 28V; Max Operating Temperature: 85°C; Max Output Current: 1A; Max Output Voltage: 5V; Min Input Voltage: 8V; Min Operating Temperature: -40°C; Mount: Through Hole; Output Power: 5W; Package Quantity: 42; Packaging: Rail/Tube; Voltage - Output 1: 5V; Weight: 2g; Width: 8.5mm; Supplier 1: Digi-Key; Supplier Part Number 1: 945-2201-ND
R30 = RES 0805 2 1%: Resistor Surface Mount, 2 Ohms, 0805 Footprint, 1% Tolerance 0.125W; Manufacturer: Various; PCB Package: 0805; Description in Visual: Res SMT 2 0805  1%  0.125W; Value: 2; P/N: RES 0805 2 1%; Manufacturer P/N: Various; Power_Rating: 0.125W; Tolerance: 1%

## Sheet IO.SchDoc
size Letter; Organization: Penn Electric Racing; Address1: 220 S. 33rd St; Address2: Towne Bldg B11; Address3: Philadelpia, PA 19104; Address4: USA; DocumentNumber: 7; SheetNumber: 7; SheetTotal: 7
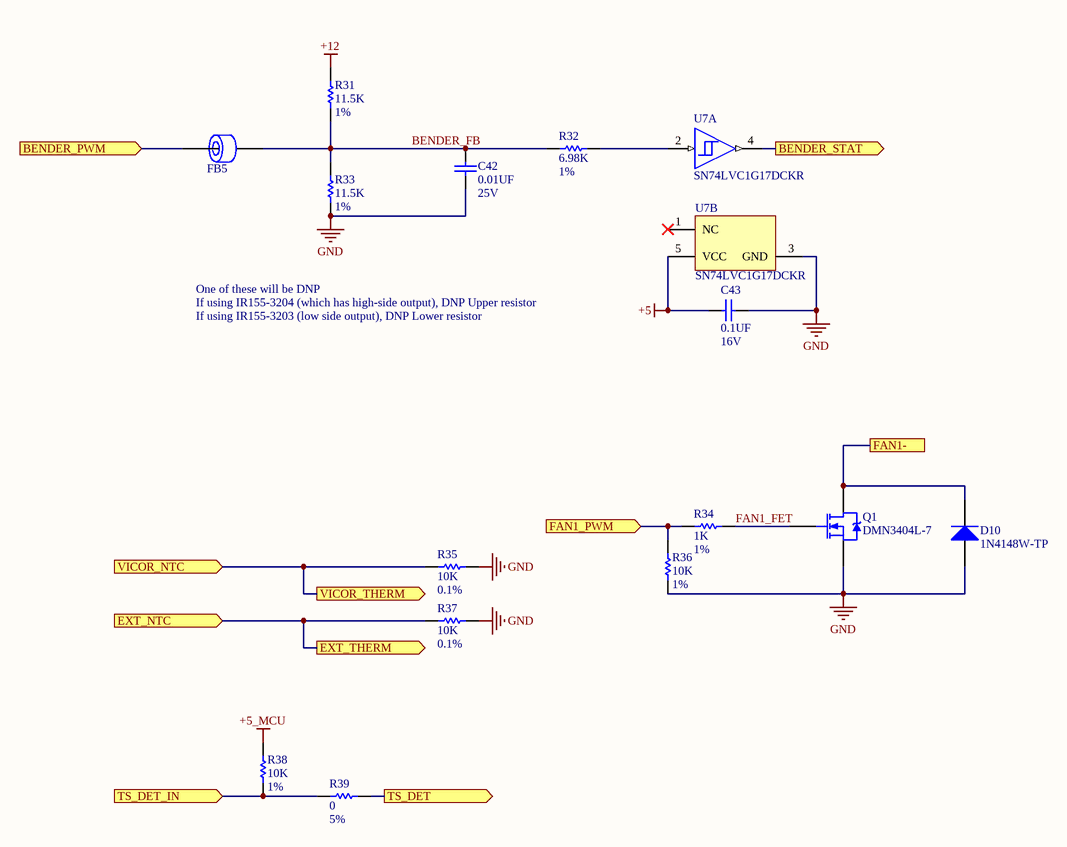
[diagram p5: IO.SchDoc]

### Parts
C42  Val: 0.01UF  Vol: 25V  [0603_CAP]  (hidden comment: CAP 0603 0.01UF 25V 10% X7R)
C43  Val: 0.1UF  Vol: 16V  [0603_CAP]  (hidden comment: CAP 0603 0.1UF 16V 10% X7R)
D10  1N4148W-TP  [MCC-SOD123_V]
FB5  Ferrite Chip 2500 Ohms  [0603]  (value not drawn)
Q1  DMN3404L-7  [SOT23-FET-DI]
R31  Val: 11.5K  Tol: 1%  [0603_RES]  (hidden comment: RES 0603 11.5K 1%)
R32  Val: 6.98K  Tol: 1%  [0603_RES]  (hidden comment: RES 0603 6.98K 1%)
R33  Val: 11.5K  Tol: 1%  [0603_RES]  (hidden comment: RES 0603 11.5K 1%)
R34  Val: 1K  Tol: 1%  [0603_RES]  (hidden comment: RES 0603 1K 1%)
R35  Val: 10K  Tol: 0.1%  [0603_RES]  (hidden comment: RES 0603 10K 0.1%)
R36  Val: 10K  Tol: 1%  [0603_RES]  (hidden comment: RES 0603 10K 1%)
R37  Val: 10K  Tol: 0.1%  [0603_RES]  (hidden comment: RES 0603 10K 0.1%)
R38  Val: 10K  Tol: 1%  [0603_RES]  (hidden comment: RES 0603 10K 1%)
R39  Val: 0  Tol: 5%  [0603_RES]  (hidden comment: RES 0603 0 5%)
U7  SN74LVC1G17DCKR  [DCK0005A_L]  (parts A,B of 2)

### Ports
BENDER_PWM (in), BENDER_STAT (out), EXT_NTC (in), EXT_THERM (out), FAN1-, FAN1_PWM (in), TS_DET (out), TS_DET_IN (in), VICOR_NTC (in), VICOR_THERM (out)

### Nets
+5: C43.1 U7.5(VCC)
+5_MCU: R38.2
+12: R31.2
GND: C42.1 C43.2 D10.1(A) Q1.2(S) R33.1 R35.2 R36.1 R37.2 U7.3(GND)
BENDER_FB: C42.2 FB5.2 R31.1 R32.2 R33.2
BENDER_PWM: FB5.1 ; port BENDER_PWM
BENDER_STAT: U7.4(Y) ; port BENDER_STAT
EXT_NTC_N: R37.1 ; port EXT_THERM, port EXT_NTC
FAN1-: D10.2(K) Q1.3(D) ; port FAN1-
FAN1_FET: Q1.1(G) R34.2
FAN1_PWM: R34.1 R36.2 ; port FAN1_PWM
TS_DET: R39.2 ; port TS_DET
TS_DET_IN: R38.1 R39.1 ; port TS_DET_IN
VICOR_NTC: R35.1 ; port VICOR_THERM, port VICOR_NTC
NetR32_1: R32.1 U7.2(A)

Not connected (* = marked no-connect by the designer): U7 1(NC)*

### Notes on the sheet
- One of these will be DNP
- If using IR155-3204 (which has high-side output), DNP Upper resistor
- If using IR155-3203 (low side output), DNP Lower resistor
- Title:
- Size:
- Date:
- Desc:
- Letter
- Auth:
- Sheet
- Proj:
- *
- of
- www.uvmaero.org
- File:

### Library data of the parts
C42 = CAP 0603 0.01UF 25V 10% X7R: Capacitor Surface Mount 0603 Footprint 0.01UF 25V 10% Tolerance Ceramic X7R; Manufacturer: Various; PCB Package: 0603; Description in Visual: Cap SMT 0603 0.01UF 25V 10%  Cer X7R; P/N: CAP 0603 0.01UF 25V 10% X7R; Manufacturer P/N: Various; Value: 0.01UF; Voltage: 25V; Tolerance: 10%; Type: Ceramic X7R; ComponentLink1Description: Manufacturer Website; ComponentLink2Description: Component Datasheet; ComponentLink3Description: Octopart Link
C43 = CAP 0603 0.1UF 16V 10% X7R: as C41 on sheet Power Supply; P/N: CAP 0603 0.1UF 16V 10% X7R; Manufacturer P/N: Various; Value: 0.1UF; Voltage: 16V; Tolerance: 10%; Type: Ceramic X7R; ComponentLink1Description: Manufacturer Website; ComponentLink2Description: Component Datasheet; ComponentLink3Description: Octopart Link
D10 = CMP-2000-04993-1: High Speed Switching Diode, 400 mW, 150 mA, -65 to 150 degC, 2-Pin SOD123, RoHS, Tape and Reel; Manufacturer: Micro Commercial Components; Reverse Recovery Time-Max: 4ns; Average Forward Current-Max: 0.15A; Peak Current-Max: 2A; Power Dissipation: 400mW; Reverse Voltage-Max [Vrrm]: 100V; Datasheet URL: https://datasheet.ciiva.com/16836/1n4148wsod123-16836277.pdf; Package Reference: SOD123; Package URL: http://www.mccsemi.com/up_pdf/1N4448W(SOD-123).pdf; Package Description: 2-Pin Small Outline Diode, Body 2.7 x 1.6 mm, Height 1.35 mm; Manufacturer URL: http://www.mccsemi.com/; Datasheet Version: Rev. C, 07/2014
FB5 = MMZ1608A252B: as FB3 on sheet MCU; P/N: MMZ1608A252B; Manufacturer P/N: MMZ1608A252B; Filter type: Differential Mode - Single; Operating Temperature Range: -55 to +125 °C; PCB Package: 0603; ComponentLink1Description: Manufacturer Website; ComponentLink1URL: http://www.tdk.com/; ComponentLink2Description: Component Datasheet; ComponentLink2URL: http://www.tdk.co.jp/tefe02/e9412_mmz1608.pdf; ComponentLink3Description: Octopart Link; ComponentLink3URL: http://octopart.com/partsearch/#search/requestData&q=MMZ1608A252B
Q1 = DMN3404L-7: N-Channel 30V 5.8A (Ta) 720mW (Ta) Surface Mount SOT-23-3; Manufacturer: Diodes; Drain to Source Resistance: 82mR; Element Configuration: Single; Fall Time: 6.18ns; Gate to Source Voltage (Vgs): 20V; Input Capacitance: 386pF; Max Power Dissipation: 1.4W; Nominal Vgs: 1.5V; Number of Channels: 1; On-State Resistance: 28mR; Turn-Off Delay Time: 13.92ns; Turn-On Delay Time: 3.41ns; Case/Package: SOT-23; Category: MOSFETs; Contact Plating: Tin,Matte; Continuous Drain Current (ID): 5.8A; Drain to Source Breakdown Voltage: 30V; Drain to Source Voltage (Vdss): 30V; Height: 1mm; Lead Free: Lead Free; Length: 2.9mm; Manufacturer Part Number: DMN3404L-7; Max Operating Temperature: 150°C; Min Operating Temperature: -55°C; Mount: Surface Mount; Number of Elements: 1; Number of Pins: 3; Package Quantity: 3000; Packaging: Tape and Reel; Power Dissipation: 1.4W; Rds On Max: 28mR; REACH SVHC: No SVHC; Rise Time: 6.18ns; Threshold Voltage: 1.5V; Weight: 0.000282oz; Width: 1.3mm; Supplier 1: Digi-Key; Supplier Part Number 1: DMN3404LDICT-ND
R31 R33 = RES 0603 11.5K 1%: Resistor Surface Mount, 11.5K Ohms, 0603 Footprint, 1% Tolerance 0.1W; Manufacturer: Various; PCB Package: 0603; Description in Visual: Res SMT 11.5K 0603  1%  0.1W; P/N: RES 0603 11.5K 1%; Manufacturer P/N: Various; Value: 11.5K; Power_Rating: 0.1W; Tolerance: 1%
R32 = RES 0603 6.98K 1%: Resistor Surface Mount, 6.98K Ohms, 0603 Footprint, 1% Tolerance 0.1W; Manufacturer: Various; PCB Package: 0603; Description in Visual: Res SMT 6.98K 0603  1%  0.1W; P/N: RES 0603 6.98K 1%; Manufacturer P/N: Various; Value: 6.98K; Power_Rating: 0.1W; Tolerance: 1%
R34 = RES 0603 1K 1%: as R27 on sheet MCU; P/N: RES 0603 1K 1%; Manufacturer P/N: Various; Value: 1K; Power_Rating: 0.1W; Tolerance: 1%
R35 R37 = RES 0603 10K 0.1%: Resistor Surface Mount, 10K Ohms, 0603 Footprint, 0.1% Tolerance 0.1W; Manufacturer: Various; PCB Package: 0603; Description in Visual: Res SMT 10K 0603  0.1%  0.1W; P/N: RES 0603 10K 0.1%; Manufacturer P/N: Various; Value: 10K; Power_Rating: 0.1W; Tolerance: 0.1%
R36 R38 = RES 0603 10K 1%: as R23 on sheet MCU; P/N: RES 0603 10K 1%; Manufacturer P/N: Various; Value: 10K; Power_Rating: 0.1W; Tolerance: 1%
R39 = RES 0603 0 5%: as R29 on sheet MCU; P/N: RES 0603 0 5%; Manufacturer P/N: Various; Power_Rating: 0.1W; Tolerance: 5%
U7 = CMP-0859-00388-4: Single Schmitt-Trigger Buffer, DCK0005A, LARGE T&R; Manufacturer: Texas Instruments; tpd @ Nom Voltage(Max)(ns): 11,6.5,5.5,5; Bits(#): 1; VCC(Min)(V): 1.65; F @ Nom Voltage(Max)(Mhz): 150; VCC(Max)(V): 5.5; Input Type: CMOS/TTL; Sub-Family: Non-Inverting Buffer/Driver; Output Type: CMOS; Output Drive (IOL/IOH)(Max)(mA): 32/-32; 3-State Output: No; Logic: True; ICC @ Nom Voltage(Max)(mA): 0.01; Voltage(Nom)(V): 1.8,2.5,3.3,5; Rating: Catalog; Schmitt Trigger: Yes; Technology Family: LVC; PackageReference: DCK0005A; DatasheetVersion: SCES351V; Generic Part Number: SN74LVC1G17; Operating Temperature Range(C): -40 to 125,-40 to 85

## Sheet Current Sense.SchDoc
size Letter; DocumentNumber: 3; SheetNumber: 3; SheetTotal: 7
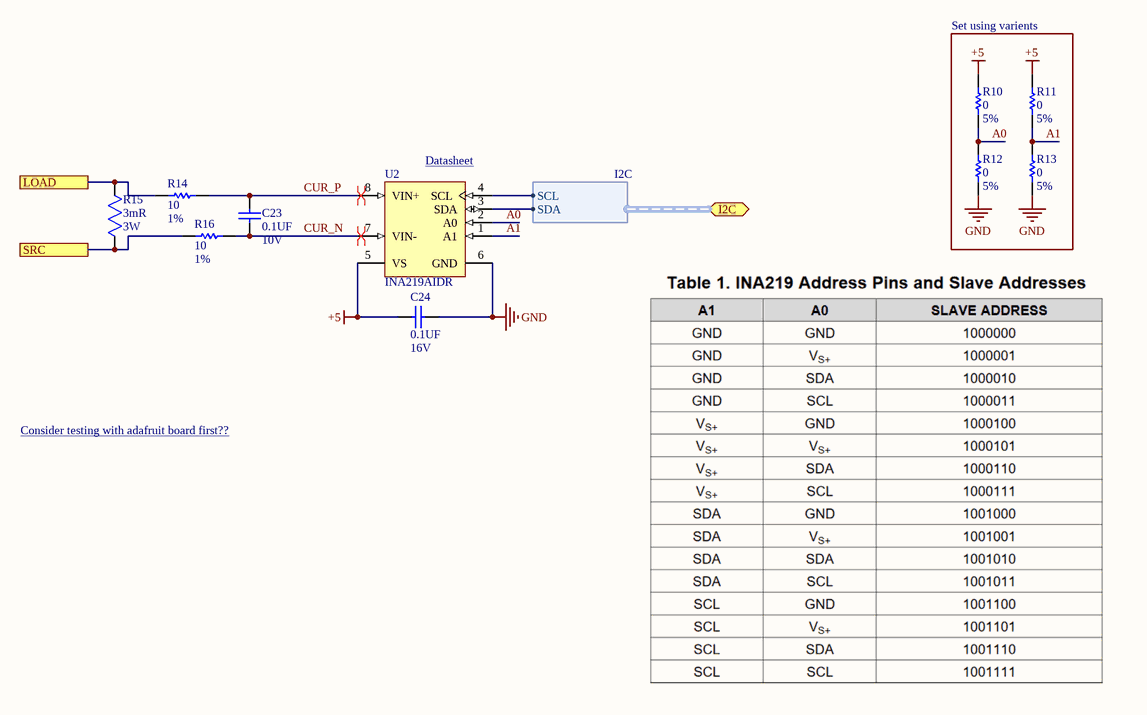
[diagram p6: Current Sense.SchDoc]

### Parts
C23  Val: 0.1UF  Vol: 10V  [0603_CAP]  (hidden comment: CAP 0603 0.1UF 10V 10% X7R)
C24  Val: 0.1UF  Vol: 16V  [0603_CAP]  (hidden comment: CAP 0603 0.1UF 16V 10% X7R)
R10  Val: 0  Tol: 5%  [0603_RES]  (hidden comment: RES 0603 0 5%)
R11  Val: 0  Tol: 5%  [0603_RES]  (hidden comment: RES 0603 0 5%)
R12  Val: 0  Tol: 5%  [0603_RES]  (hidden comment: RES 0603 0 5%)
R13  Val: 0  Tol: 5%  [0603_RES]  (hidden comment: RES 0603 0 5%)
R14  Val: 10  Tol: 1%  [0603_RES]  (hidden comment: RES 0603 10 1%)
R15  Resistance: 3mR  Power Rating: 3W  [RES_6432-M]  (hidden comment: KRL6432E-M-R003-F-T1)
R16  Val: 10  Tol: 1%  [0603_RES]  (hidden comment: RES 0603 10 1%)
U2  INA219AIDR  [D0008A_N]

### Blocks framed on the sheet
Set using varients: R10-R13

### Ports
I2C (bidir, harness I2C), LOAD, SRC

### Harnesses
I2C: SCL, SDA

### Nets
+5: C24.1 R10.2 R11.2 U2.5(VS)
+DCDC_OUT: R14.1 R15.2 ; port LOAD
GND: C24.2 R12.1 R13.1 U2.6(GND)
A0: R10.1 R12.2 U2.2(A0)
A1: R11.1 R13.2 U2.1(A1)
CUR_N: C23.1 R16.2 U2.7(VIN-)
CUR_P: C23.2 R14.2 U2.8(VIN+)
DCDC_OUT+: R15.1 R16.1 ; port SRC
I2C.SCL: U2.4(SCL) ; port I2C.SCL
I2C.SDA: U2.3(SDA) ; port I2C.SDA

### Layout directives
differential pair: CUR_N, CUR_P

### Notes on the sheet
- (near U2) Datasheet <http://www.ti.com/lit/ds/symlink/ina219.pdf>
- Consider testing with adafruit board first?? <https://www.adafruit.com/product/904>
- Title:
- Size:
- Date:
- Desc:
- Letter
- Auth:
- Sheet
- Proj:
- *
- of
- www.uvmaero.org
- File:

### Library data of the parts
C23 = CAP 0603 0.1UF 10V 10% X7R: Capacitor Surface Mount 0603 Footprint 0.1UF 10V 10% Tolerance Ceramic X7R; Manufacturer: Various; PCB Package: 0603; Description in Visual: Cap SMT 0603 0.1UF 10V 10%  Cer X7R; P/N: CAP 0603 0.1UF 10V 10% X7R; Manufacturer P/N: Various; Value: 0.1UF; Voltage: 10V; Tolerance: 10%; Type: Ceramic X7R; ComponentLink1Description: Manufacturer Website; ComponentLink2Description: Component Datasheet; ComponentLink3Description: Octopart Link
C24 = CAP 0603 0.1UF 16V 10% X7R: as C41 on sheet Power Supply; P/N: CAP 0603 0.1UF 16V 10% X7R; Manufacturer P/N: Various; Value: 0.1UF; Voltage: 16V; Tolerance: 10%; Type: Ceramic X7R; ComponentLink1Description: Manufacturer Website; ComponentLink2Description: Component Datasheet; ComponentLink3Description: Octopart Link
R10-R13 = RES 0603 0 5%: as R29 on sheet MCU; P/N: RES 0603 0 5%; Manufacturer P/N: Various; Power_Rating: 0.1W; Tolerance: 5%
R14 R16 = RES 0603 10 1%: Resistor Surface Mount, 10 Ohms, 0603 Footprint, 1% Tolerance 0.1W; Manufacturer: Various; PCB Package: 0603; Description in Visual: Res SMT 10 0603  1%  0.1W; Value: 10; P/N: RES 0603 10 1%; Manufacturer P/N: Various; Power_Rating: 0.1W; Tolerance: 1%
R15 = KRL6432E-M-R003-F-T1: 3 mOhms ±1% 3W Chip Resistor Wide 2512 (6432 Metric), 1225 Automotive AEC-Q200, Current Sense Metal Foil; Manufacturer: Susumu; Temperature Coefficient: 50ppm/°C; Width: 3.1mm; Case Code (Imperial): 2512; Case Code (Metric): 6432; Case/Package: 2512; Category: Chip SMD Resistors; Composition: Metal Foil; Height: 0.5mm; Length: 6.3mm; Manufacturer Part Number: KRL6432E-M-R003-F-T1; Max Operating Temperature: 155°C; Min Operating Temperature: -55°C; Package Quantity: 1000; Packaging: Tape and Reel; Termination: SMD/SMT; Tolerance: 1%; Weight: 0.001429oz; Supplier 1: Digi-Key; Supplier Part Number 1: 408-1613-1-ND
U2 = INA219AIDR: Zero-Drift, Bi-Directional Current / Power Monitor, 3 to 5.5 V, -40 to 125 degC, 8-pin SOIC (D8), Green (RoHS & no Sb/Br); Manufacturer: Texas Instruments; Common Mode Range(Min)(V): 0; SubFamily: Current Shunt Monitor; Rating: Catalog; Input Offset (+/-)(Max)(uV): 100; Vs(Max)(V): 5.5; Common Mode Range(Max)(V): 26; Quiescent Current (+/-)(Typ)(mA): 0.7; Vs(Min)(V): 3; Gain(V/V): 1, 0.5, 0.25, 0.125; Small-Signal Bandwidth(Typ)(MHz): 0.011; PackageReference: D0008A; ComponentLink1URL: http://www.ti.com/; Eco-Plan: Green (RoHS & no Sb/Br); ComponentLink2URL: http://www.ti.com/general/docs/lit/getliterature.tsp?genericPartNumber=INA219&fileType=pdf; ComponentLink1Description: Manufacturer URL; ComponentLink3Description: Package Specification; Mounting Technology: Surface Mount; PackageDescription: 8-Pin Plastic Small Outline, Body 4.9 x 3.9 mm, Pitch 1.27 mm; ComponentLink3URL: http://www.ti.com/lit/ml/msoi002j/msoi002j.pdf; DatasheetVersion: SBOS448F; PackageVersion: 4040047-3/M, 06/2011; PartNumber: INA219AIDR; Code_JEDEC: MS-012; ComponentLink2Description: Datasheet; CMRR(Min)(dB): 100; Supplier 1: Digi-Key; Supplier Part Number 1: 296-23978-1-ND

## Nets that join several sheets
+5: Top (J4.2 J6.6), DCDC (C18.2 C21.2 PS1.1 U1.1), CAN (C26.2 U3.3), MCU (C34.2 R26.2 U4.5 U6.18), Power Supply (C40.2 C41.2 PS2.3), IO (C43.1 U7.5), Current Sense (C24.1 R10.2 R11.2 U2.5)
+5_MCU: MCU (13 pins), IO (R38.2)
+12: Top (J1.2), Power Supply (C38.2 FB4.2 L5.1 R30.1), IO (R31.2)
+DCDC_OUT: Top (J2.1), Current Sense (R14.1 R15.2)
GND: Top (D1.1 D2.3 D3.1 MTG2.1), DCDC (C18.1 C21.1 PS1.2 U1.4), CAN (5 pins), MCU (19 pins), Power Supply (8 pins), IO (9 pins), Current Sense (C24.2 R12.1 R13.1 U2.6)
HV_IN+: Top (J3.1 J3.2), DCDC (C5.1 C7.2 L3.2)
HV_IN-: Top (J5.1 J5.2), DCDC (C7.1 C14.2 L3.1)
PGND: Top (J2.2 MTG1.1 NT1.2), DCDC (13 pins)
BENDER_PWM: Top (D1.4 J6.5), IO (FB5.1)
BENDER_STAT: MCU (U5.14), IO (U7.4)
BSPD_FAULT: Top (D1.3 J6.7), MCU (U5.25)
CAN_N: Top (J6.1), CAN (L4.4 R18.1)
CAN_P: Top (J6.3), CAN (L4.1 R17.2)
CUR_OUT: Top (D1.2 J6.9), MCU (U5.24)
DCDC_EN: DCDC (U1.3), MCU (U5.2)
DCDC_FLT: DCDC (U1.2), MCU (U5.1)
DCDC_OUT+: DCDC (F1.2 F1.4 I1.1), Current Sense (R15.1 R16.1)
EXT_NTC_N: Top (D3.2 J6.4), MCU (U5.22), IO (R37.1)
FAN1-: Top (J1.1), IO (D10.2 Q1.3)
FAN1_PWM: MCU (U5.9), IO (R34.1 R36.2)
FAN2_PWM: Top (D3.4 J6.10), MCU (U5.10)
I2C.SCL: MCU (R25.1 U5.28), Current Sense (U2.4)
I2C.SDA: MCU (R24.1 U5.27), Current Sense (U2.3)
IN+: Top (J6.2), Power Supply (F2.1)
IN-: Top (NT1.1), Power Supply (D9.2 L6.1)
RX: CAN (U3.4), MCU (U6.2)
TS_DET: MCU (U5.26), IO (R39.2)
TS_DET_IN: Top (D3.3 J6.8), IO (R38.1 R39.1)
TX: CAN (U3.1), MCU (U6.1)
VICOR_NTC: Top (D2.1 D2.2 J4.1), MCU (U5.19), IO (R35.1)

## Assembly variants
As Built: not fitted JP1 R6 R31 RV1
Filter Bypass: not fitted C1 C2 C3 C9 C10 C11 C12 C13 L2 R1 R4 R6 R31 RV1
As Built - Alternate Bulk Resistor: not fitted JP1 R6 R31 RV1